# EAGLE design TinyCard (EAGLE 7.6.0)
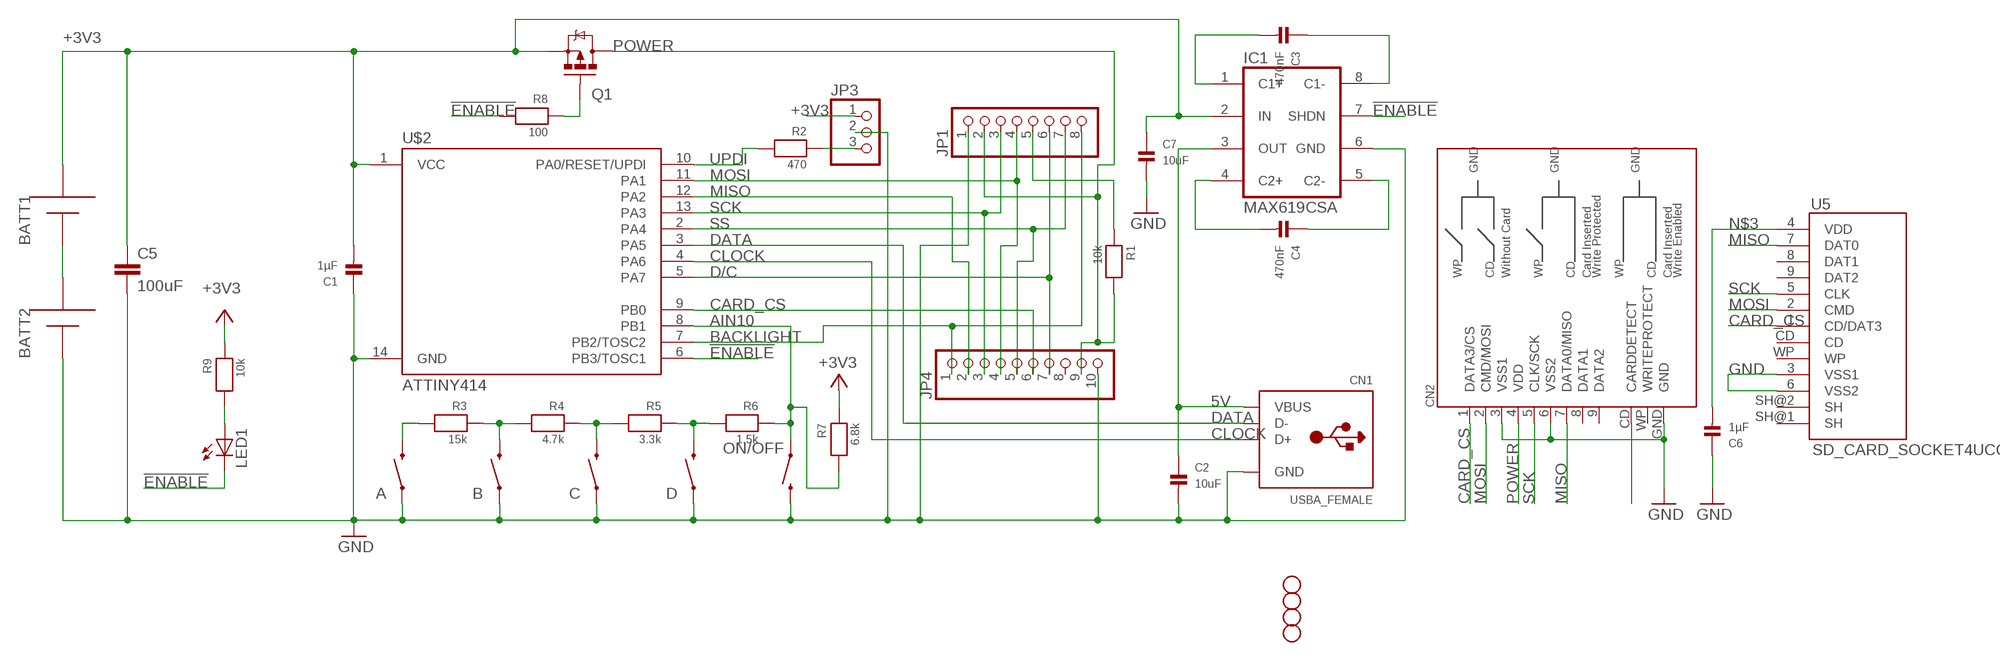
[diagram p0: schematic, sheet 1]

## Parts
A  SWITCH-MOMENTARY-212MM  [TACTILE-PTH-12MM]
B  SWITCH-MOMENTARY-212MM  [TACTILE-PTH-12MM]
BATT1  AAA  [12BH412]
BATT2  AAA  [12BH412]
C  SWITCH-MOMENTARY-212MM  [TACTILE-PTH-12MM]
C1  1µF  CAP_CERAMIC_0805MP  [_0805MP]
C2  10uF  CAP_CERAMIC_0805MP  [_0805MP]
C3  470nF  CAP_CERAMIC_0805MP  [_0805MP]
C4  470nF  CAP_CERAMIC_0805MP  [_0805MP]
C5  100uF  100UF6.3V20%(1210)  [1210]
C6  1µF  CAP_CERAMIC_0805MP  [_0805MP]
C7  10uF  CAP_CERAMIC_0805MP  [_0805MP]
CN1  USBA_FEMALE  USB_TYPEAPTHFML  [USB_HOST-PTH]
CN2  SDCARD  [SDCARD_SMT_4U06132]
D  SWITCH-MOMENTARY-212MM  [TACTILE-PTH-12MM]
IC1  MAX619CSA  [SO08]
JP1  HEADER-1X8ROUND  [1X08_ROUND]
JP3  HEADER-1X3ROUND  [1X03_ROUND]
JP4  HEADER-1X10ROUND  [1X10_ROUND]
JP5  STAND-OFF  [STAND-OFF]
JP6  STAND-OFF  [STAND-OFF]
JP7  STAND-OFF  [STAND-OFF]
JP8  STAND-OFF  [STAND-OFF]
LED1  LEDCHIPLED_0805  [CHIPLED_0805]
ON/OFF  SWITCH-MOMENTARY-2PTH  [TACTILE-PTH]
Q1  MOSFET-PCHANNELSMD  [SOT23-3]
R1  10k  RESISTOR_0805MP  [_0805MP]
R2  470  RESISTOR_0805MP  [_0805MP]
R3  15k  RESISTOR_0805MP  [_0805MP]
R4  4.7k  RESISTOR_0805MP  [_0805MP]
R5  3.3k  RESISTOR_0805MP  [_0805MP]
R6  1.5k  RESISTOR_0805MP  [_0805MP]
R7  6.8k  RESISTOR_0805MP  [_0805MP]
R8  100  RESISTOR_0805MP  [_0805MP]
R9  10k  RESISTOR_0805MP  [_0805MP]
U5  SD_CARD_SOCKET4UCON  [SDCARD_4UCONN]
U$2  ATTINY414  [SO14]

## Nets
5V: C2.1 CN1.VBUS IC1.3(OUT)
!ENABLE: IC1.7(SHDN) LED1.C R8.2 U$2.6(PB3/TOSC1)
+3V3: BATT1.+ C1.2 C5.1 C7.1 IC1.2(IN) JP3.1 Q1.2(S) R7.1 R9.1 U$2.1(VCC)
AIN10: ON/OFF.1 R6.1 R7.2 U$2.8(PB1)
BACKLIGHT: JP1.8 JP4.1 U$2.7(PB2/TOSC2)
CARD_CS: CN2.1(DATA3/CS) JP4.6 U5.1(CD/DAT3) U$2.9(PB0)
CLOCK: CN1.D+ U$2.4(PA6)
D/C: JP1.6 JP4.7 U$2.5(PA7)
DATA: CN1.D- U$2.3(PA5)
GND: A.1 B.1 BATT2.- C1.1 C2.2 C5.2 C6.1 C7.2 C.1 CN1.GND CN2.3(VSS1) CN2.6(VSS2) CN2.GND D.1 IC1.6(GND) JP1.1 JP3.2 JP4.10 ON/OFF.3 U5.3(VSS1) U5.6(VSS2) U$2.14(GND)
MISO: CN2.7(DATA0/MISO) JP4.2 U5.7(DAT0) U$2.12(PA2)
MOSI: CN2.2(CMD/MOSI) JP1.4 JP4.4 U5.2(CMD) U$2.11(PA1)
N$1: BATT1.- BATT2.+
N$2: A.3 R3.2
N$3: C6.2 U5.4(VDD)
N$4: JP1.5 R1.1
N$5: C3.2 IC1.1(C1+)
N$6: C3.1 IC1.8(C1-)
N$8: B.3 R3.1 R4.2
N$9: C.3 R4.1 R5.2
N$10: D.3 R5.1 R6.2
N$11: LED1.A R9.2
N$12: C4.2 IC1.4(C2+)
N$13: C4.1 IC1.5(C2-)
N$20: CN2.CD(CARDDETECT)
N$48: Q1.1(G) R8.1
N$78: JP3.3 R2.1
POWER: CN2.4(VDD) JP1.2 JP4.9 Q1.3(D) R1.2
SCK: CN2.5(CLK/SCK) JP1.3 JP4.3 U5.5(CLK) U$2.13(PA3)
SS: JP1.7 JP4.5 U$2.2(PA4)
UPDI: R2.2 U$2.10(PA0/RESET/UPDI)
Unconnected: CN2.8(DATA1) CN2.9(DATA2) CN2.WP(WRITEPROTECT) JP4.8 U5.8(DAT1) U5.9(DAT2) U5.CD U5.SH@1(SH) U5.SH@2(SH) U5.WP

## Library data of the parts
A B C D = SparkFun-Electromechanical:SWITCH-MOMENTARY-2: Various NO switches- pushbuttons, reed, etc; PROD_ID: SWCH-09185
BATT1 BATT2 = adafruit:AAA: AAA PC pin holder Mouser part #12BH412 - but pretty much any 1x AAA battery holder should be the same http://www.ladyada.net/library/pcb/eaglelibrary.html
C1-C4 C6 C7 = microbuilder:CAP_CERAMIC: Ceramic Capacitors 0402 - 0402 Surface Mount Capacitors 16pF 50V 5% [Digikey: 445-4899-2-ND] 18pF 50V 5% [Digikey: 490-1281-2-ND] 22pF 50V 5% [Digikey: 490-1283-2-ND] 68pF 50V 5% [Digikey: 490-1289-2-ND] 0.1uF 10V 10% [Digikey: 490-1318-2-ND] 1.0uF 6.3V 10% [Digikey: 490-1320-2-ND] 0603 - 0603 Surface Mount Capacitors 16 pF 50V 5% [Digikey: 445-5051-2-ND] 22 pF 50V [Digikey: PCC220ACVTR-ND] 33 pF 50V 5% [Digikey: 490-1415-1-ND] 56pF 50V 5% [Digikey: 490-1421-1-ND] 220pF 50V 5% [Digikey: 445-1285-1-ND] 680 pF 50V 2200 pF 50V 5% C0G [Digikey: 445-1297-1-ND] 5600 pF 100V 5% X7R [Digikey: 478-3711-1-ND] 0.1 µF 25V 10% [Digikey: PCC2277TR-ND] 0.22 µF 16V 10% X7R [Digikey: 445-1318-1-ND] 1.0 µF 25V 10% [Digikey: 445-5146-2-ND] 0603 - RF Specific 3pF 250V +/-0.1pF RF [Digikey: 712-1347-1-ND] 18 pF 250V 5% [Digikey: 478-3505-1-ND or 712-1322-1-ND] 56 pF 250V 5% C0G RF [Digikey: 490-4867-1-ND] 68 pF 250V RF [Digikey: 490-4868-1-ND] 0805 - 0805 Surface Mount Capacitors 220 pF 250V 2% RF Ceramic Capacitor [Digikey: 712-1398-1-ND] 1000 pF 50V 2% NP0 Ceramic Capacitor [Digikey: 478-3760-1-ND] 0.1 µF 25V 10% Ceramic Capacitor [Digikey: PCC1828TR-ND] 1.0 µF 16V 10% Ceramic Capacitor[Digikey: 490-1691-2-ND] 10.0 µF 10V 10% Ceramic Capacitor[Digikey: 709-1228-1-ND] 10.0 uF 16V 10% Ceramic Capacitor [Digikey: 478-5165-2-ND] 47 uF 6.3V 20% Ceramic Capacitor [Digikey: 587-1779-1-ND or 399-5506-1-ND] 1206 - 1206 Surface Mount Capacitors 47uF 10V 20% Ceramic Capacitor [Digikey: 490-5528-1-ND or 399-5508-1-ND or 445-6010-1-ND] 100uF 6.3V -20%, +80% Y5V Ceramic Capacitor (Digikey: 490-4512-1-ND, Mouser: 81-GRM31CF50J107ZE1L)
C5 = SparkFun-Capacitors:100UF6.3V20%(1210): CAP-09827; PROD_ID: CAP-09827
CN1 = microbuilder:USB_TYPEA: USB - Type A Connectors Male types stick out and are inserted into a PC or matching females parts (these are the connectors used on USB Memory Sticks, etc.). Female parts are generally used for USB Host and accept a male-type connector. SMT - 4UCON: 10017 PTHFML - Digikey: 609-1045-ND, 4UCon: 05241 PCB - Use 2.0mm thick PCBs with this footprint
CN2 = microbuilder:SDCARD: SD Card Reader 06132 = Inexpensive SMT 19646 = Push/Pull SMT
IC1 = technoblogy:MAX619CSA: SWITCHING REGULATOR; MPN: MAX634CSA+; OC_FARNELL: 1673203; OC_NEWARK: 68K4925
JP1 = technoblogy:HEADER-1X8: PIN HEADER
JP3 = microbuilder:HEADER-1X3: PIN HEADER
JP4 = technoblogy:HEADER-1X10: PIN HEADER
JP5-JP8 = SparkFun:STAND-OFF: Stand Off This is the mechanical footprint for a #4 phillips button head screw. Use the keepout ring to avoid running the screw head into surrounding components. SKU : PRT-00447
LED1 = adafruit:LED: LED OSRAM: - CHIPLED LG R971, LG N971, LY N971, LG Q971, LY Q971, LO R971, LY R971 LH N974, LH R974 LS Q976, LO Q976, LY Q976 LO Q996 - Hyper CHIPLED LW Q18S LB Q993, LB Q99A, LB R99A - SideLED LS A670, LO A670, LY A670, LG A670, LP A670 LB A673, LV A673, LT A673, LW A673 LH A674 LY A675 LS A676, LA A676, LO A676, LY A676, LW A676 LS A679, LY A679, LG A679 - Hyper Micro SIDELED® LS Y876, LA Y876, LO Y876, LY Y876 LT Y87S - SmartLED LW L88C, LW L88S LB L89C, LB L89S, LG L890 LS L89K, LO L89K, LY L89K LS L896, LA L896, LO L896, LY L896 - TOPLED LS T670, LO T670, LY T670, LG T670, LP T670 LSG T670, LSP T670, LSY T670, LOP T670, LYG T670 LG T671, LOG T671, LSG T671 LB T673, LV T673, LT T673, LW T673 LH T674 LS T676, LA T676, LO T676, LY T676, LB T676, LH T676, LSB T676, LW T676 LB T67C, LV T67C, LT T67C, LS T67K, LO T67K, LY T67K, LW E67C LS E67B, LA E67B, LO E67B, LY E67B, LB E67C, LV E67C, LT E67C LW T67C LS T679, LY T679, LG T679 LS T770, LO T770, LY T770, LG T770, LP T770 LB T773, LV T773, LT T773, LW T773 LH T774 LS E675, LA E675, LY E675, LS T675 LS T776, LA T776, LO T776, LY T776, LB T776 LHGB T686 LT T68C, LB T68C - Hyper Mini TOPLED® LB M676 - Mini TOPLED Santana® LG M470 LS M47K, LO M47K, LY M47K Source: http://www.osram.convergy.de/
ON/OFF = SparkFun-Electromechanical:SWITCH-MOMENTARY-2: Various NO switches- pushbuttons, reed, etc; PROD_ID: SWCH-08441
Q1 = SparkFun-DiscreteSemi:MOSFET-PCHANNEL: Generic PMOSFET IRLML2244 - TRANS-11153 (SOT-23 -20V -4.3A) (1.Gate 2.Source 3.Drain) FQP27P06 - COM-10349 <http://www.sparkfun.com/products/10349> (TO-220 -60V -27A) (1.Gate 2.Source 3.Drain)
R1-R9 = microbuilder:RESISTOR: Resistors 0402 - 0402 Surface Mount Package 22 Ohm 1% 1/16W [Digikey: 311-22.0LRTR-ND] 33 Ohm 5% 1/16W 1.0K 5% 1/16W 1.5K 5% 1/16W 2.0K 1% 1/16W 10.0K 1% 1/16W [Digikey: 311-10.0KLRTR-ND] 10.0K 5% 1/16W [Digikey: RMCF0402JT10K0TR-ND] 12.1K 1% 1/16W [Digikey: 311-22.0LRTR-ND] 100.0K 5% 1/16W 0603 - 0603 Surface Mount Package 0 Ohm 1/10 Watt 1% Resistor 15 Ohm 1/10 Watt 1% Resistor 33 Ohm 1/10 Watt 1% Resistor 49.9 Ohm 1/10 Watt 1% Resistor 100 Ohm 1/10 Watt 1% Resistor 150 Ohm 1/10 Watt 1% Resistor 240 Ohm 1/10 Watt 1% Resistor 390 Ohm 1/10 Watt 1% Resistor 560 Ohm 1/10 Watt 1% Resistor 680 Ohm 1/10 Watt 1% Resistor 750 Ohm 1/10 Watt 1% Resistor 1.0K Ohm 1/10 Watt 1% Resistor 1.5K Ohm 1/10 Watt 1% Resistor 2.0K Ohm 1/10 Watt 1% Resistor 2.2K Ohm 1/10 Watt 1% Resistor 3.3K Ohm 1/10 Watt 1% Resistor 4.7K Ohm 1/10 Watt 1% Resistor 10.0K Ohm 1/10 Watt 1% Resistor 12.0K Ohm 1/10 Watt 1% Resistor 12.1K Ohm 1/10 Watt 1% Resistor 20.0K Ohm 1/10 Watt 1% Resistor 33.0K Ohm 1/10 Watt 1% Resistor 100.0K Ohm 1/10 Watt 1% Resistor 0805 - 0805 Surface Mount Package 0 Ohm 1/8 Watt 1% Resistor 33 Ohm 1/8 Watt 1% Resistor 100 Ohm 1/8 Watt 1% Resistor 150 Ohm 1/8 Watt 1% Resistor 200 Ohm 1/8 Watt 1% Resistor 240 Ohm 1/8 Watt 1% Resistor 330 Ohm 1/8 Watt 1% Resistor 390 Ohm 1/8 Watt 1% Resistor 470 Ohm 1/8 Watt 1% Resistor 1.0K Ohm 1/8 Watt 1% Resistor 1.5K Ohm 1/8 Watt 1% Resistor 2.0K Ohm 1/8 Watt 1% Resistor 4.7K Ohm 1/8 Watt 1% Resistor 5.1K Ohm 1/8 Watt 1% Resistor 5.6K Ohm 1/8 Watt 1% Resistor 10.0K Ohm 1/8 Watt 1% Resistor 22.0K Ohm 1/8 Watt 1% Resistor 33.0K Ohm 1/8 Watt 1% Resistor 100K Ohm 1/8 Watt 1% Resistor 1206 - 1206 Surface Mount Package 2012 - 2010 Surface Mount Package 0.11 Ohm 1/2 Watt 1% Resistor - Digikey: RHM.11UCT-ND
U5 = SparkFun-Connectors:SD_CARD_SOCKET: SD Memory Card Connector, push-push normal type, CD enable, WP enable
U$2 = technoblogy:ATTINY414: Atmel 14-pin 2/4/8kB flash uC; PROD_ID: IC-11285

## Net classes
1 power: width 0.305 mm

## Board
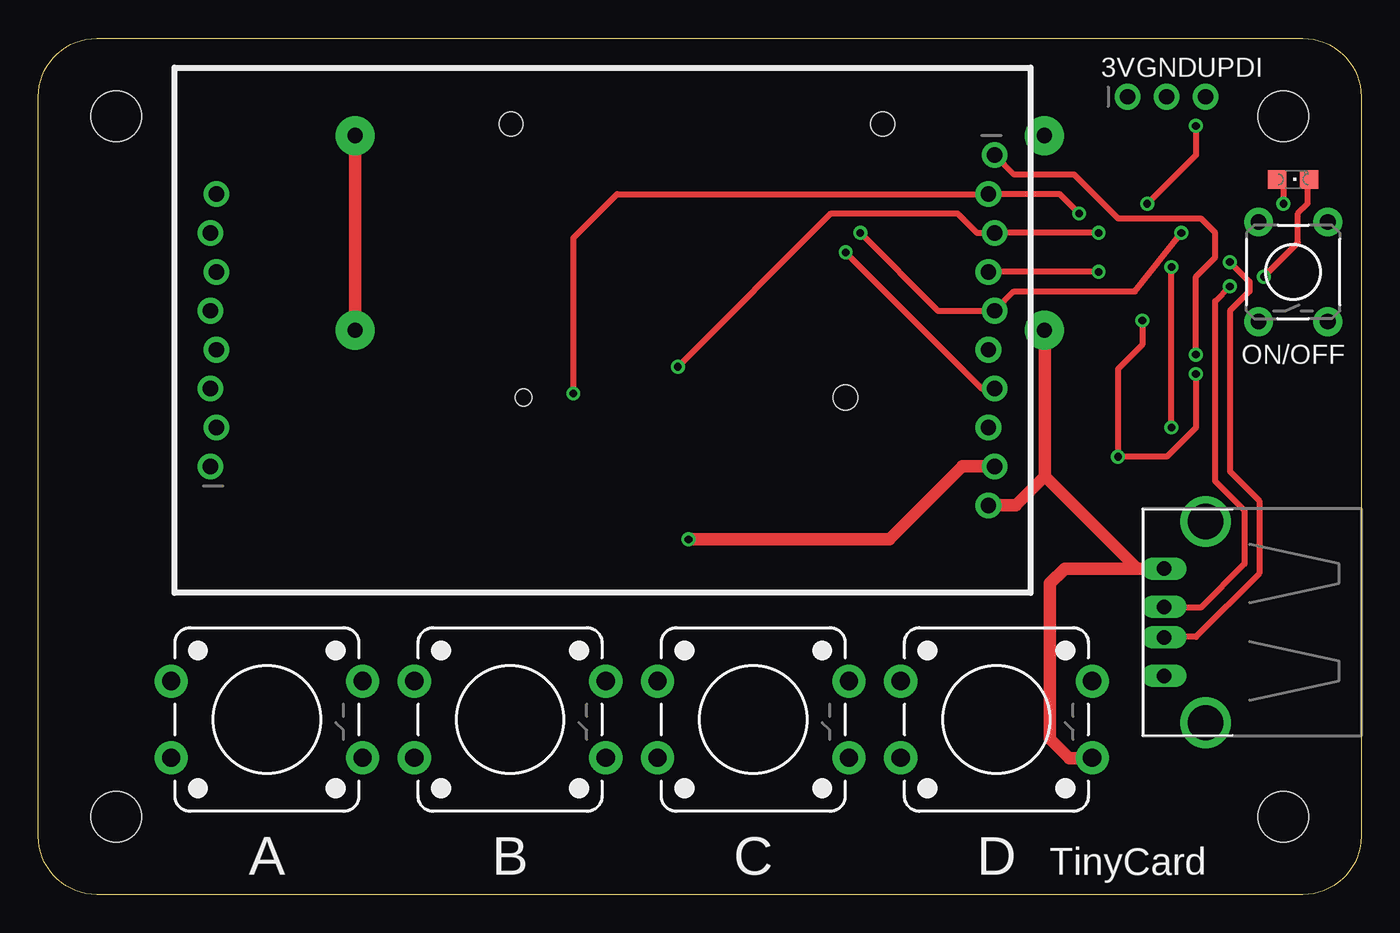
[diagram p1: board, top side]
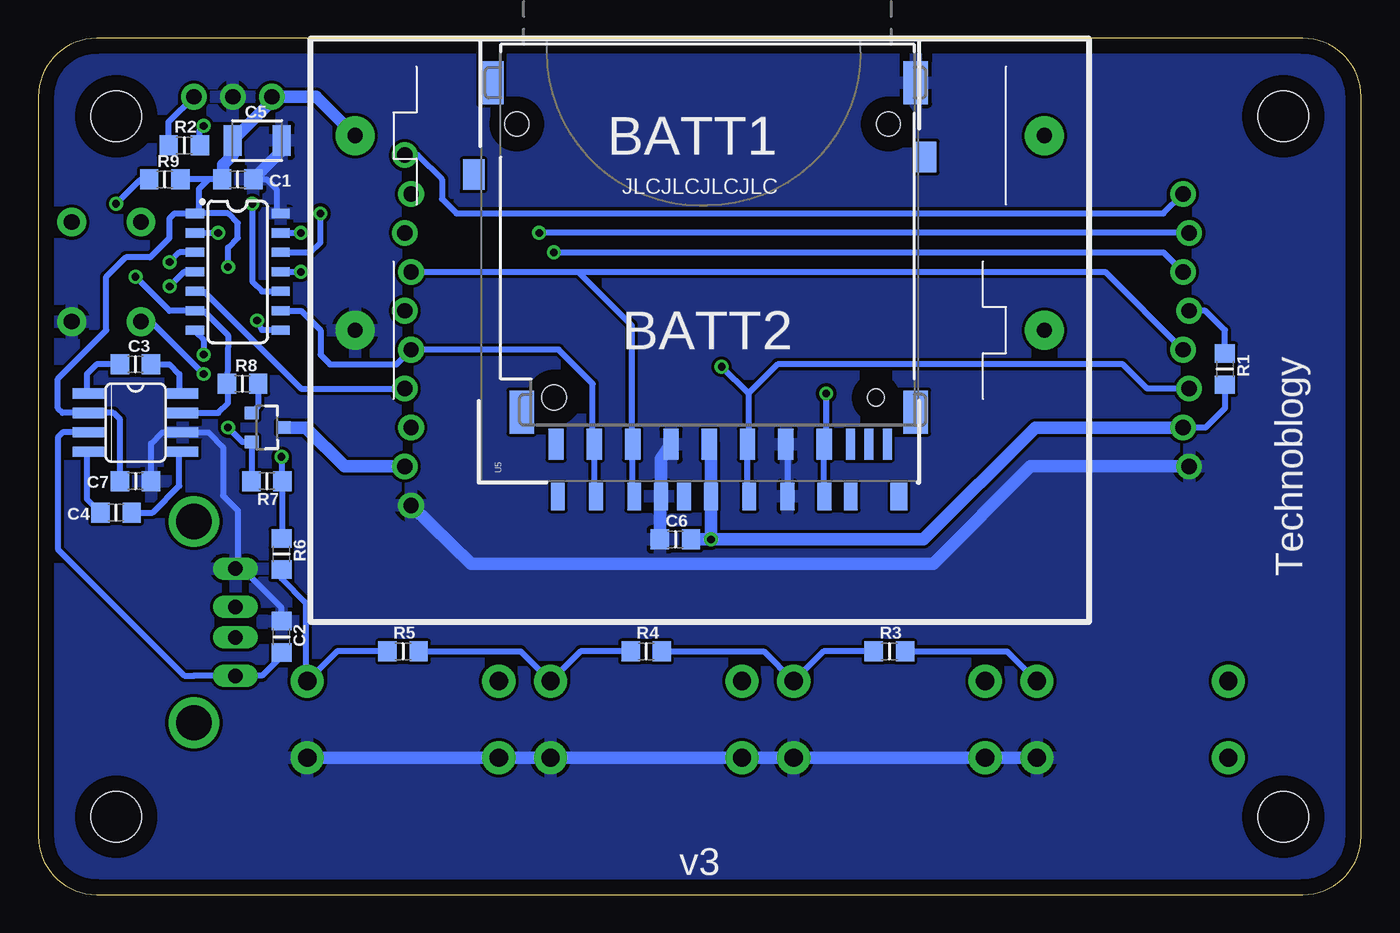
[diagram p2: board, bottom side, seen from below]

Size 86.36 x 55.88 mm. Coordinates in mm from the lower left corner, seen from the top.
Outline: 3.81,0 arc-90 0,3.81 0,52.07 arc-90 3.81,55.88 82.55,55.88 arc-90 86.36,52.07 86.36,3.81 arc-90 82.55,0 3.81,0
Copper layers (1*16): Top 0.035mm / dielectric 1.5mm / Bottom 0.035mm
Design rules "default *": minimum track width 4mil, minimum drill 6mil, track to track 8mil, track to pad 8mil, pad to pad 8mil, via to via 8mil, smd to smd 8mil, copper to edge 40mil, drill to drill 8mil, minimum pad ring 10mil, minimum via ring 8mil, stop-mask expansion 4mil, vias tented up to drill 25mil, thermal gap 10mil

### Footprints (pad centres in the part's own frame; a part is rotated, then mirrored left to right if it is on the bottom)
TACTILE-PTH-12MM = drill 1.2 pad 2.159: 1 6.25,-2.5; 2 -6.25,-2.5; 3 6.25,2.5; 4 -6.25,2.5
12BH412 = drill 1 pad 2.54: + 22.5,0; - -22.5,0
_0805MP = smd 1.2 x 1.3: 1 -1.016,0; 2 1.016,0
1210 = smd 1.2 x 2: 1 -1.6,0; 2 1.6,0
USB_HOST-PTH = drill 0.95 long: D+ 1,6.52; D- -1,6.52; GND 3.5,6.52; VBUS -3.5,6.52 | drill 2.3 pad 2.9: S1 -6.57,3.81; S2 6.57,3.81
SDCARD_SMT_4U06132 = smd 1 x 2.008: 1 6.88,11.254; 2 4.38,11.254; 3 1.88,11.254; 4 -0.62,11.254; 5 -3.12,11.254; 6 -5.62,11.254; 7 -8.12,11.254; 9 9.38,11.254 | smd 0.6 x 2.008: 8 -9.845,11.254; CD -11.045,11.254; WP -12.245,11.254 | smd 1.6 x 2.8: GND -14.1,-12.35; NC1 -14.1,9.15; NC2 11.631,9.15; NC3 13.6,-12.35 | hole 1.6: 9.5,8.2 | hole 1.1: -11.5,8.2
SO08 = smd 0.66 x 2.032: 1 -1.905,-3.073; 2 -0.635,-3.073; 3 0.635,-3.073; 4 1.905,-3.073; 5 1.905,3.073; 6 0.635,3.073; 7 -0.635,3.073; 8 -1.905,3.073
1X08_ROUND = drill 1 pad 1.676: 1 -8.89,0.203; 2 -6.35,-0.203; 3 -3.81,0.203; 4 -1.27,-0.203; 5 1.27,0.203; 6 3.81,-0.203; 7 6.35,0.203; 8 8.89,-0.203
1X03_ROUND = drill 1 pad 1.676: 1 -2.54,0; 2 0,0; 3 2.54,0
1X10_ROUND = drill 1 pad 1.676: 1 -11.43,0.203; 2 -8.89,-0.203; 3 -6.35,0.203; 4 -3.81,-0.203; 5 -1.27,0.203; 6 1.27,-0.203; 7 3.81,0.203; 8 6.35,-0.203; 9 8.89,0.203; 10 11.43,-0.203
STAND-OFF = hole 3.302: 0,0
CHIPLED_0805 = smd 1.2 x 1.2: A 0,-1.05; C 0,1.05
TACTILE-PTH = drill 1.016 pad 1.88: 1 -3.251,2.261; 2 3.251,2.261; 3 -3.251,-2.261; 4 3.251,-2.261
SOT23-3 = smd 0.8 x 0.9: 1 -0.95,-1; 2 0.95,-1; 3 0,1.1
SDCARD_4UCONN = smd 1.8 x 0.9: 1 -1,6.77; 2 -1,4.27; 3 -1,2.52; 4 -1,-0.73; 5 -1,-3.23; 6 -1,-5.73; 7 -1,-8.15; 8 -1,-9.85; 9 -1,9.27; CD -1,1.02 | smd 2 x 1.4: SH@1 20,14.75; SH@2 21.15,-14.75 | smd 1.8 x 1.1: WP -1,-13 | hole 1.55: 23.3,11.94; 23.3,-12.32
SO14 = smd 0.6 x 1.2: 1 -3.81,-2.8; 2 -2.54,-2.8; 3 -1.27,-2.8; 4 0,-2.8; 5 1.27,-2.8; 6 2.54,-2.8; 7 3.81,-2.8; 8 3.81,2.8; 9 2.54,2.8; 10 1.27,2.8; 11 0,2.8; 12 -1.27,2.8; 13 -2.54,2.8; 14 -3.81,2.8

### Placement (x,y rotation side)
A  14.92,11.43 0 top
B  30.8,11.43 0 top
BATT1  43.18,49.53 180 bottom
BATT2  43.18,36.83 0 bottom
C  46.67,11.43 0 top
C1  73.34,46.67 180 bottom
C2  70.48,16.83 90 bottom
C3  80.01,34.61 180 bottom
C4  81.28,24.92 180 bottom
C5  72.07,49.21 0 bottom
C6  44.77,23.18 0 bottom
C7  80.01,26.99 0 bottom
CN1  80.01,17.78 90 top
CN2  43.18,40.64 180 bottom
D  62.55,11.43 0 top
IC1  80.01,30.8 270 bottom
JP1  11.43,36.83 90 top
JP3  73.66,52.07 0 top
JP4  62.23,36.83 270 top
JP5  5.08,50.8 0 top
JP6  81.28,5.08 0 top
JP7  5.08,5.08 0 top
JP8  81.28,50.8 0 top
LED1  81.92,46.67 270 top
ON/OFF  81.92,40.64 90 top
Q1  71.44,30.48 270 bottom
R1  8.89,34.29 270 bottom
R2  76.84,48.9 0 bottom
R3  30.8,15.88 0 bottom
R4  46.67,15.88 0 bottom
R5  62.55,15.88 0 bottom
R6  70.48,22.23 270 bottom
R7  71.44,26.99 0 bottom
R8  73.03,33.34 180 bottom
R9  78.11,46.67 180 bottom
U5  43.18,26.99 90 bottom
U$2  73.34,40.64 270 bottom

### Tracks (layer width: path | path; a pad name or v marks a point on that pad's centre or on a via)
5V
  Bottom 0.406: C2.1 70.48,15.56 71.76,14.29 CN1.VBUS 76.19,14.28 76.2,14.29 76.84,14.29 85.09,22.54 85.09,29.84 84.77,30.16 IC1.3
!ENABLE  (via drill 0.5)
  Top 0.406: v80.01,40.32 82.23,42.55 82.23,44.45 82.87,45.09 82.87,46.26 LED1.C
  Bottom 0.406: v80.01,40.32 77.79,38.1 U$2.6 75.56,38.1 73.98,36.51 R8.2 73.98,33.59 73.98,32.07 74.61,31.43 IC1.7
+3V3  (via drill 0.5)
  Top 0.406: v73.98,30.48 v73.98,40.96
  Bottom 0.406: C1.2 75.25,46.67 | U$2.1 75.88,44.71 75.88,46.04 75.25,46.67 | U$2.1 77.47,44.45 77.79,44.13 77.79,42.86 79.06,41.59 80.65,41.59 81.92,40.32 81.92,36.83 85.09,33.66 85.09,31.75 84.77,31.43 IC1.2 81.44,31.43 81.03,31.02 C7.1 | R7.1 72.44,27 Q1.2 73.03,29.53 v73.98,30.48 | v73.98,40.96 73.98,42.23 73.34,42.86 73.34,43.81 73.98,44.45 U$2.1 | 75.25,46.67 R9.1
  Bottom 0.813: BATT1.+ 68.22,52.07 JP3.1 71.12,51.77 C5.1 73.67,48.25 74.3,47.62 74.3,46.74 C1.2
AIN10  (via drill 0.5)
  Top 0.406: v72.07,37.47 72.07,35.88 70.48,34.29 v70.48,28.57 73.66,28.57 75.56,30.48 v75.56,33.97
  Bottom 0.406: U$2.8 71.76,36.83 v72.07,37.47 | R6.1 70.42,23.3 R7.2 70.48,27.05 v70.48,28.57 | ON/OFF.1 78.98,37.39 v75.56,33.97
BACKLIGHT  (via drill 0.5)
  Top 0.406: v75.56,35.24 75.56,40.32 76.84,41.59 76.84,43.18 75.88,44.13 70.48,44.13 67.63,46.99 63.7,46.99 JP4.1
  Bottom 0.406: U$2.7 76.14,36.77 75.56,36.2 v75.56,35.24 | JP4.1 61.59,48.26 60.01,46.67 60.01,45.4 59.05,44.45 12.9,44.45 JP1.8
CARD_CS
  Bottom 0.406: U5.1 50.06,25.99 CN2.1 50.16,29.28 50.16,33.34 52.39,35.56 JP4.6 62.98,34.61 67.31,34.61 67.95,35.24 67.95,36.83 69.22,38.1 U$2.9
CLOCK  (via drill 0.5)
  Top 0.406: CN1.D+ 73.54,18.73 75.88,18.73 78.74,21.59 78.74,25.08 76.84,26.99 76.84,38.73 v77.79,39.69
  Bottom 0.406: U$2.4 76.84,40.64 v77.79,39.69
D/C  (via drill 0.5)
  Top 0.406: v52.7,41.91 61.59,33.02 JP4.7
  Bottom 0.406: U$2.5 75.56,39.37 69.22,33.02 JP4.7 | v52.7,41.91 12.9,41.91 JP1.6
DATA  (via drill 0.5)
  Top 0.406: v77.79,41.27 79.06,40.01 79.06,39.37 77.79,38.1 77.79,27.62 79.69,25.72 79.69,20.95 75.56,16.83 73.54,16.83 CN1.D-
  Bottom 0.406: U$2.3 77.15,41.91 v77.79,41.27
GND
  Top 0.406: CN1.GND
  Top 0.813: D.1 68.76,8.89 67.31,8.89 66.04,10.16 66.04,20.32 67,21.28 CN1.GND 71.75,21.28 65.72,27.3 | JP4.10 63.82,25.4 65.72,27.3 | BATT2.- 65.72,36.83 65.72,27.3
  Bottom 0.406: C1.1 71.44,46.67 70.8,46.04 70.8,44.71 U$2.14 | CN2.6 37.45,29.39 U5.6 37.46,25.99 | U5.3 45.72,25.99 | 70.48,18.41 70.48,18.73 73.03,21.28 CN1.GND 73.34,21.43 73.34,25.08 74.3,26.04 74.3,29.21 75.25,30.16 IC1.6 78.26,30.16 78.99,29.43 C7.2
  Bottom 0.813: A.1 B.1 C.1 D.1 68.76,8.89 | JP4.10 58.1,21.59 27.94,21.59 21.59,27.94 JP1.1 11.23,28.19 | CN2.3 45.7,28.43 U5.3 45.78,25.99 C6.1 | C5.2 70.47,48.53 C1.1
  pour Bottom: 0,55.88 0,0 86.36,0 86.36,55.88
MISO  (via drill 0.5)
  Top 0.406: v67.95,44.45 66.67,45.72 JP4.2 37.78,45.72 34.92,42.86 v34.92,32.7
  Bottom 0.406: CN2.7 35.06,29.66 | U5.7 35.06,25.99 CN2.7 | v34.92,32.7 34.92,29.52 CN2.7 | U$2.12 68.58,41.91 67.95,42.55 v67.95,44.45
MOSI  (via drill 0.5)
  Top 0.406: v69.22,40.64 JP4.4
  Bottom 0.406: U5.2 47.56,25.99 CN2.2 47.62,29.45 47.62,37.15 51.12,40.64 | 51.12,40.64 16.71,40.64 JP1.4 | JP4.4 51.12,40.64 | U$2.11 v69.22,40.64
N$1
  Top 0.813: BATT1.- BATT2.+
N$2
  Bottom 0.406: R3.2 23.11,15.87 A.3
N$3
  Bottom 0.406: 42.39,23.18 42.45,23.18
  Bottom 0.813: C6.2 42.45,23.18 U5.4
N$4
  Bottom 0.406: R1.1 8.89,36.83 10.16,38.1 JP1.5
N$5
  Bottom 0.406: C3.2 82.55,34.61 83.19,33.97 83.19,32.8 IC1.1
N$6
  Bottom 0.406: C3.1 77.79,34.61 77.15,33.97 77.15,32.92 IC1.8
N$8
  Bottom 0.406: R3.1 35.1,15.88 B.3 38.99,15.87 R4.2
N$9
  Bottom 0.406: R4.1 50.98,15.88 C.3 54.86,15.87 R5.2
N$10
  Bottom 0.406: R5.1 66.85,15.88 D.3 68.9,14.03 68.9,19.05 70.48,20.64 R6.2
N$11  (via drill 0.5)
  Top 0.406: LED1.A 81.28,46.67 v81.28,45.09
  Bottom 0.406: R9.2 79.76,46.61 v81.28,45.09
N$12
  Bottom 0.406: IC1.4 83.19,28.79 83.19,25.81 C4.2
N$13
  Bottom 0.406: C4.1 78.9,24.92 77.15,26.67 77.15,28.68 IC1.5
N$48
  Bottom 0.406: 72.64,31.64 Q1.1 72.01,31.86 R8.1
N$78
  Bottom 0.406: R2.1 77.85,50.42 JP3.3
POWER  (via drill 0.5)
  Top 0.813: JP4.9 60.32,27.94 55.56,23.18 v42.45,23.18
  Bottom 0.406: R1.2 8.89,31.75 10.16,30.48 JP1.2 | CN2.4 42.45,29.39
  Bottom 0.813: JP4.9 66.36,27.94 68.9,30.48 Q1.3 | JP1.2 21.27,30.48 28.57,23.18 v42.45,23.18 42.45,23.19 42.45,29.39
SCK  (via drill 0.5)
  Top 0.406: v41.75,34.45 51.75,44.45 60.01,44.45 61.28,43.18 JP4.3 v69.22,43.18
  Bottom 0.406: JP1.3 13.97,33.02 15.56,34.61 38.1,34.61 40,32.7 | U5.5 40.06,25.99 CN2.5 40,29.44 40,32.7 | v41.75,34.45 40,32.7 | U$2.13 v69.22,43.18
SS  (via drill 0.5)
  Top 0.406: v53.66,43.18 58.74,38.1 JP4.5 63.7,39.37 71.6,39.37 v74.61,43.18
  Bottom 0.406: JP1.7 v53.66,43.18 | U$2.2 v74.61,43.18
UPDI  (via drill 0.5)
  Top 0.406: v75.56,50.16 75.56,48.26 v72.39,45.09
  Bottom 0.406: v72.39,45.09 72.39,40.01 71.76,39.37 U$2.10 | R2.2 75.82,49.91 v75.56,50.16

### Text on the board
tPlace: 3V | GND | UPDI | A | B | C | D | TinyCard
bPlace: JLCJLCJLCJLC | Technoblogy | v3